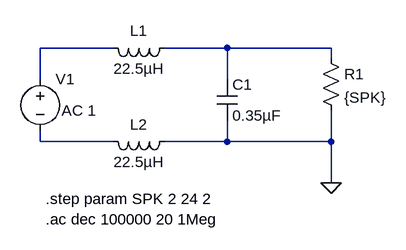
[diagram p0: schematic Draft1.asc]
Draft1.asc, the LTspice schematic file:
Version 4
SHEET 1 880 680
WIRE 128 32 16 32
WIRE 304 32 208 32
WIRE 464 32 304 32
WIRE 464 48 464 32
WIRE 16 80 16 32
WIRE 304 80 304 32
WIRE 16 176 16 160
WIRE 128 176 16 176
WIRE 304 176 304 144
WIRE 304 176 208 176
WIRE 464 176 464 128
WIRE 464 176 304 176
WIRE 464 240 464 176
FLAG 464 240 0
SYMBOL voltage 16 64 R0
WINDOW 3 33 64 Left 2
SYMATTR Value AC 1
SYMATTR InstName V1
SYMBOL ind 224 16 R90
WINDOW 0 5 56 VBottom 2
WINDOW 3 32 56 VTop 2
SYMATTR InstName L1
SYMATTR Value 22.5µH
SYMATTR SpiceLine Rser=1m
SYMBOL ind 224 160 R90
WINDOW 0 5 56 VBottom 2
WINDOW 3 32 56 VTop 2
SYMATTR InstName L2
SYMATTR Value 22.5µH
SYMATTR SpiceLine Rser=1m
SYMBOL cap 288 80 R0
SYMATTR InstName C1
SYMATTR Value 0.35µF
SYMBOL res 448 32 R0
SYMATTR InstName R1
SYMATTR Value {SPK}
TEXT 24 264 Left 2 !.step param SPK 2 24 2
TEXT 24 296 Left 2 !.ac dec 100000 20 1Meg

The netlist it stands for:
* Draft1.asc
V1 N001 N003 AC 1
L1 N002 N001 22.5µH Rser=1m
L2 0 N003 22.5µH Rser=1m
C1 N002 0 0.35µF
R1 N002 0 {SPK}
.step param SPK 2 24 2
.ac dec 100000 20 1Meg
.backanno
.end